# Altium schematic sheet Radio_and_Power.SchDoc
size A4; SheetNumber: 1; SheetTotal: 3
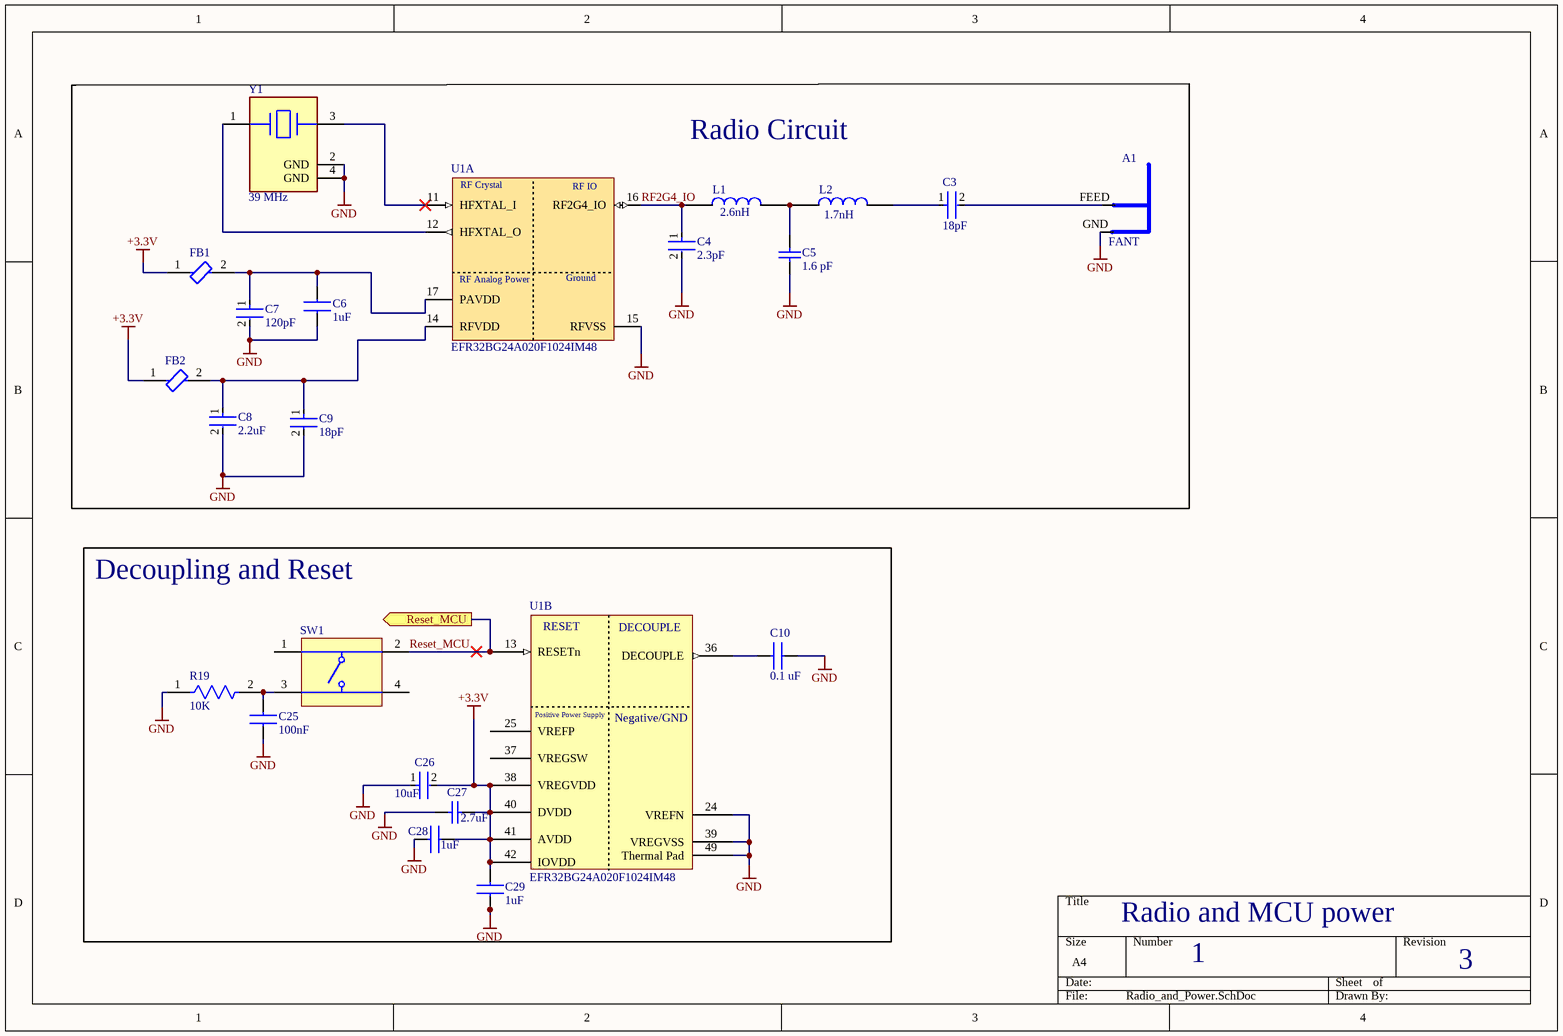
[diagram p0: Radio_and_Power.SchDoc]

## Parts
A1  FANT  [FANT_2P4]
C3  18pF  [FP-GJM155-0_05-MFG]
C4  2.3pF  [FP-GJM155-0_05-IPC_B]
C5  1.6 pF  [CAPC1005X55X25LL05T10]
C6  1uF  [CAP_1uf_2x1.25_0805]
C7  120pF  [FP-CL21-IPC_C]
C8  2.2uF  [FP-CL10-IPC_A]
C9  18pF  [FP-GJM155-0_05-MFG]
C10  0.1 uF  [Cap_1.6X0.8_0603]
C25  100nF  [Cap_1.6X0.8_0603]
C26  10uF  [FP-CL10-IPC_C]
C27  2.7uF  [CAPC2013X145X50LL20T25]
C28  1uF  [CAP_1uf_2x1.25_0805]
C29  1uF  [CAP_1uf_2x1.25_0805]
FB1  BLM18SG700TN1D  [FP-BLM18-0_15-t0_5-d1_2-IPC_A]  (value not drawn)
FB2  BLM18SG700TN1D  [FP-BLM18-0_15-t0_5-d1_2-IPC_A]  (value not drawn)
L1  2.6nH  [Inductor_2.6nH]
L2  1.7nH  [Inductor_1.7nH]
R19  10K  [FP-RMCF0603-IPC_C]
SW1  1825910-6  [TECO-1825910-6_V]  (value not drawn)
U1  EFR32BG24A020F1024IM48  [EFR32BG24_QFN_48_6x6]  (parts A,B of 3)
Y1  39 MHz  [FP-ABM8-MFG]

## Blocks framed on the sheet
Radio Circuit: A1 C3-C9 FB1 FB2 L1 L2 U1 Y1
Decoupling and Reset: C10 C25-C29 R19 SW1 U1

## Ports
Reset_MCU (out, see Sensors[5B])

## Nets
+3.3V: C26.2 C27.2 C28.1 C29.1 FB1.1 FB2.1 U1.38(VREGVDD) U1.40(DVDD) U1.41(AVDD) U1.42(IOVDD)
GND: A1.GND C4.2 C5.1 C6.2 C7.2 C8.2 C9.2 C10.1 C25.2 C26.1 C27.1 C28.2 C29.2 R19.1 U1.15(RFVSS) U1.24(VREFN) U1.39(VREGVSS) U1.49(Thermal_Pad) Y1.2(GND) Y1.4(GND)
Reset_MCU: SW1.2 U1.13(RESETn) ; port Reset_MCU
RF2G4_IO: C4.1 L1.1 U1.16(RF2G4_IO)
NetA1_FEED: A1.FEED C3.2
NetC3_1: C3.1 L2.2
NetC5_2: C5.2 L1.2 L2.1
NetC6_1: C6.1 C7.1 FB1.2 U1.17(PAVDD)
NetC8_1: C8.1 C9.1 FB2.2 U1.14(RFVDD)
NetC10_2: C10.2 U1.36(DECOUPLE)
NetC25_1: C25.1 R19.2 SW1.3
NetU1_11: U1.11(HFXTAL_I) Y1.3
NetU1_12: U1.12(HFXTAL_O) Y1.1

Not connected (* = marked no-connect by the designer): SW1 1 4; U1 25(VREFP) 37(VREGSW)

## Notes on the sheet
- Radio and MCU power
- 1
- 3
- (in symbol EFR32BG24A020F1024IM48-B, part A) RF Crystal; RF IO; Ground; RF Analog Power
- (in symbol EFR32BG24A020F1024IM48-B, part B) RESET; Positive Power Supply; Negative/GND

## Library data of the parts
A1 = F_antenna_2P4
C3 C9 = CMP-2008-03748-2: Multi-Layer Ceramic Capacitor 18pF C0G  ±2% 0402 Paper T/R; Manufacturer: Murata; Manufacturer Part Number: GJM1555C1H180GB01D; Voltage Rating (DC): 50V; Multilayer: Yes; Radiation Hardening: No; Depth: 0.5mm; Dielectric: C0G; Termination: SMD/SMT; Package Quantity: 1; Height: 0.5mm; Thickness: 0.022inch; Mount: Surface Mount; Voltage Rating: 50V; Lead Free: Lead Free; Width: 0.02inch; Case Code (Metric): 1005; Tolerance: 2%; Length: 1mm; Packaging: Tape and Reel; Case Code (Imperial): 0402; Max Operating Temperature: 125°C; Case/Package: 0402; Min Operating Temperature: -55°C; Capacitance: 18pF; Supplier: Digikey; Supplier Part Number: 490-8082-1-ND; RoHS: Yes; Category: Ceramic Capacitors; Stock: 138833; Pricing: 1=0.15, 10=0.087, 50=0.0608, 100=0.0526, 500=0.03882, 1000=0.03453, 2500=0.02999, 5000=0.02723, 10000=0.02496, 20000=0.02307, 30000=0.02212, 50000=0.02107, 70000=0.02045, 100000=0.01985, 250000=0.01856, 500000=0.01777 (USD); Mounting Technology: Surface Mount; Pins: 2; Dielectric Material: Ceramic; Package Shape: Rectangular; Terminal Finish: Nickel; JESD-609 Code: e3; Value: 18pF; Capacitor Type: Ceramic; Tolerance  (fill in as +-): 2%; Package Style: SMTMeter; Tolerance (fill in as +-): 2%; Rated DC Voltage (URdc): 50V; Temperature Characteristics Code: C0G; Reach SVHC Compliant: Yes; RoHS Compliant: Yes; ComponentLink1URL: https://datasheet.ciiva.com:443/pdfs/VipMasterIC/IC/MURE/MURE-S-A0008911154/MURE-S-A0008911186-1.pdf?src-supplier=IHS+Markit; ComponentLink1Description: https://datasheet.ciiva.com:443/pdfs/VipMasterIC/IC/MURE/MURE-S-A0008911154/MURE-S-A0008911186-1.pdf?src-supplier=IHS+Markit; ComponentLink2URL: https://datasheet.ciiva.com/29542/partnumbering-e-01-29542361.pdf?src-supplier=Digikey; ComponentLink2Description: https://datasheet.ciiva.com/29542/partnumbering-e-01-29542361.pdf?src-supplier=Digikey; ComponentLink3URL: https://datasheet.ciiva.com/29542/partnumbering-e-01-29542362.pdf?src-supplier=Digikey; ComponentLink3Description: https://datasheet.ciiva.com/29542/partnumbering-e-01-29542362.pdf?src-supplier=Digikey; ComponentLink4URL: https://datasheet.ciiva.com/29542/partnumbering-e-01-29542363.pdf?src-supplier=Digikey; ComponentLink4Description: https://datasheet.ciiva.com/29542/partnumbering-e-01-29542363.pdf?src-supplier=Digikey
C4 = CMP-06035-043077-1: Multi-Layer Ceramic Capacitor 2.3pF C0G  ±0.1pF 0402 Paper T/R; Manufacturer: Murata; Manufacturer Part Number: GJM1555C1H2R3BB01D; Voltage Rating (DC): 50V; Multilayer: Yes; Tolerance  (fill in as +-): 4.35%; Case/Package: 0402; Min Operating Temperature: -55°C; Dielectric: C0G; Max Operating Temperature: 125°C; Width: 0.02inch; Packaging: Tape and Reel; Mount: Surface Mount; Length: 1mm; Voltage Rating: 50V; Case Code (Metric): 1005; Termination: SMD/SMT; Thickness: 0.022inch; Radiation Hardening: No; Depth: 0.5mm; Package Quantity: 10000; Capacitance: 2.3pF; Height: 0.5mm; Case Code (Imperial): 0402; Supplier: Digikey; Supplier Part Number: 490-GJM1555C1H2R3BB01DCT-ND; RoHS: Yes; Category: Ceramic Capacitors; Stock: 24955; Pricing: 1=0.1, 10=0.057, 50=0.0394, 100=0.0338, 500=0.02456, 1000=0.02168, 2500=0.01863, 5000=0.01678 (USD); Mounting Technology: Surface Mount; Pins: 2; Dielectric Material: Ceramic; Package Shape: Rectangular; Terminal Finish: Nickel; JESD-609 Code: e3; Value: 2.3pF; Capacitor Type: Ceramic; Package Style: SMTMeter; Tolerance (fill in as +-): 4.35%; Rated DC Voltage (URdc): 50V; Temperature Characteristics Code: C0G; Reach SVHC Compliant: Yes; RoHS Compliant: Yes; ComponentLink1URL: https://datasheet.ciiva.com:443/pdfs/VipMasterIC/IC/MURE/MURE-S-A0004378008/MURE-S-A0004382787-1.pdf?src-supplier=IHS+Markit; ComponentLink1Description: https://datasheet.ciiva.com:443/pdfs/VipMasterIC/IC/MURE/MURE-S-A0004378008/MURE-S-A0004382787-1.pdf?src-supplier=IHS+Markit; ComponentLink2URL: https://datasheet.ciiva.com/166/product-166998.pdf?src-supplier=Digikey; ComponentLink2Description: https://datasheet.ciiva.com/166/product-166998.pdf?src-supplier=Digikey
C5 = CMP-1034-00125-2: Manufacturer: Murata; Part Number: GRM1555C1H1R6BA01D; Description: Ceramic Capacitor, Multilayer, Ceramic, 50V, 6.25% +Tol, 6.25% -Tol, C0G, 30ppm/Cel TC, 0.0000016uF, Surface Mount, 0402; Dielectric Material: Ceramic; Value: 1.6pF; Multilayer: Yes; Tolerance  (fill in as +-): 6.25%; Rated DC Voltage (URdc): 50V; Temperature Characteristics Code: C0G; Supplier: Digikey; Supplier Part Number: 490-6214-1-ND; Manufacturer Part Number: GRM1555C1H1R6BA01D; RoHS: Yes; Category: Ceramic Capacitors; Stock: 106623; Pricing: 1=0.1, 10=0.043, 50=0.0294, 100=0.0252, 500=0.01812, 1000=0.01592, 2500=0.01358, 5000=0.01216 (USD); Mounting Technology: Surface Mount; Pins: 2; Package Shape: Rectangular; Case/Package: 0402; Terminal Finish: Nickel; Min Operating Temperature: -55°C; Max Operating Temperature: 125°C; JESD-609 Code: e3; Capacitor Type: Ceramic; Package Style: SMTMeter; Packaging: Tape and Reel; Tolerance (fill in as +-): 6.25%; Termination: Wraparound; Length: 1mm; Width: 0.5mm; Height: 0.5mm; Reach SVHC Compliant: Yes; RoHS Compliant: Yes; ComponentLink1URL: https://datasheet.ciiva.com:443/pdfs/VipMasterIC/IC/MURE/MURE-S-A0004280628/MURE-S-A0004344755-1.pdf?src-supplier=IHS+Markit; ComponentLink1Description: https://datasheet.ciiva.com:443/pdfs/VipMasterIC/IC/MURE/MURE-S-A0004280628/MURE-S-A0004344755-1.pdf?src-supplier=IHS+Markit; ComponentLink2URL: https://datasheet.ciiva.com/6270/grm1555c1h1r6ba01-01-6270912.pdf?src-supplier=Digikey; ComponentLink2Description: https://datasheet.ciiva.com/6270/grm1555c1h1r6ba01-01-6270912.pdf?src-supplier=Digikey; ComponentLink3URL: https://datasheet.ciiva.com/11615/product-11615783.pdf?src-supplier=Avnet; ComponentLink3Description: https://datasheet.ciiva.com/11615/product-11615783.pdf?src-supplier=Avnet; ComponentLink4URL: https://datasheet.ciiva.com/18184/getdatasheetpartid-319318-18184245.pdf?src-supplier=Verical; ComponentLink4Description: https://datasheet.ciiva.com/18184/getdatasheetpartid-319318-18184245.pdf?src-supplier=Verical; ComponentLink5URL: https://datasheet.ciiva.com/6270/partnumbering-e-01-6270909.pdf?src-supplier=Digikey; ComponentLink5Description: https://datasheet.ciiva.com/6270/partnumbering-e-01-6270909.pdf?src-supplier=Digikey; ComponentLink6URL: https://datasheet.ciiva.com/5438/product-5438044.pdf?src-supplier=Mouser; ComponentLink6Description: https://datasheet.ciiva.com/5438/product-5438044.pdf?src-supplier=Mouser
C6 C28 C29 = Cap_0805: Multilayer Ceramic Capacitor, 1 uF, 25 V, ï¿½ 10%, X7R, 0805 [2012 Metric]; Manufacturer: Samsung; Manufacturer Part Number: CL21B105KAFNNNE; Voltage: 25V; Supplier: Digikey; Supplier Part Number: 1276-1066-1-ND; RoHS: Yes; Category: Ceramic Capacitors; Stock: 1207799; Pricing: 1=0.1, 10=0.062, 50=0.0356, 100=0.0276, 500=0.02078, 1000=0.01633 (USD); Mounting Technology: Surface Mount; Case/Package: 0805; Case Code (Metric): 2012; Case Code (Imperial): 0805; Min Operating Temperature: -55°C; Max Operating Temperature: 125°C; Value: 1uF; Tolerance: 10%; Dielectric: X7R; Voltage Rating (DC): 25V; Series: CL; Packaging: Tape and Reel; Voltage Rating: 25V; Package Quantity: 1; Construction: Flat; Length: 2mm; Width: 0.049inch; Height: 1.25mm; Depth: 1.25mm; Thickness: 0.053inch; Radiation Hardening: No; Lead Free: Lead Free; RoHS Compliant: Yes; ComponentLink1URL: https://datasheet.ciiva.com/25800/cl21b105kafnnne-25800163.pdf?src-supplier=Digikey; ComponentLink1Description: https://datasheet.ciiva.com/25800/cl21b105kafnnne-25800163.pdf?src-supplier=Digikey; ComponentLink2URL: https://datasheet.ciiva.com/15195/getdatasheetpartid-355205-15195880.pdf?src-supplier=Verical; ComponentLink2Description: https://datasheet.ciiva.com/15195/getdatasheetpartid-355205-15195880.pdf?src-supplier=Verical
C7 = CMP-13271-002834-1: CL21 Series 0805 120pF 200V ±5% Tolerance C0G Multilayer Ceramic Chip Capacitor; Manufacturer: Samsung; Manufacturer Part Number: CL21C121JDCNNNC; Multilayer: Yes; Case Code (Imperial): 0805; Depth: 1.25mm; Voltage Rating (DC): 200V; Capacitance: 120pF; Radiation Hardening: No; Packaging: Tape and Reel; Case/Package: 0805; Tolerance: 5%; Height: 0.85mm; Min Operating Temperature: -55°C; Thickness: 0.037inch; Max Operating Temperature: 125°C; Mount: Surface Mount; Package Quantity: 1; Dielectric: C0G; Case Code (Metric): 2012; Length: 2mm; Lead Free: Lead Free; Width: 0.049inch; Voltage Rating: 200V; Supplier: Digikey; Supplier Part Number: 1276-1201-1-ND; RoHS: Yes; Category: Ceramic Capacitors; Stock: 1615424; Pricing: 1=0.1, 10=0.053, 50=0.0316, 100=0.0249, 500=0.01836, 1000=0.0152 (USD); Mounting Technology: Surface Mount; Pins: 2; Dielectric Material: Ceramic; Package Shape: Rectangular; Terminal Finish: Nickel; JESD-609 Code: e3; Value: 120pF; Capacitor Type: Ceramic; Tolerance  (fill in as +-): 5%; Package Style: SMTMeter; Tolerance (fill in as +-): 5%; Rated DC Voltage (URdc): 200V; Temperature Characteristics Code: C0G; Termination: Wraparound; Reach SVHC Compliant: Yes; RoHS Compliant: Yes; ComponentLink1URL: https://datasheet.ciiva.com:443/pdfs/VipMasterIC/IC/SEMS/SEMS-S-A0008522756/SEMS-S-A0008522707-1.pdf?src-supplier=IHS+Markit; ComponentLink1Description: https://datasheet.ciiva.com:443/pdfs/VipMasterIC/IC/SEMS/SEMS-S-A0008522756/SEMS-S-A0008522707-1.pdf?src-supplier=IHS+Markit; ComponentLink2URL: https://datasheet.ciiva.com/25737/cl21c121jdcnnnc-25737252.pdf?src-supplier=Digikey; ComponentLink2Description: https://datasheet.ciiva.com/25737/cl21c121jdcnnnc-25737252.pdf?src-supplier=Digikey
C8 = CMP-13271-000835-1: Cap Ceramic 2.2uF 16V X5R ±10% Pad SMD 0603 +85°C T/R; Manufacturer: Samsung; Manufacturer Part Number: CL10A225KO8NNNC; Multilayer: Yes; Case Code (Metric): 1608; Height: 0.8mm; Case/Package: 0603; Depth: 0.8mm; Capacitance: 2.2uF; Voltage Rating: 16V; Case Code (Imperial): 0603; Length: 1.6mm; Packaging: Tape and Reel; Material: Ceramic; Lead Free: Lead Free; Max Operating Temperature: 85°C; Contact Plating: Tin; Thickness: 0.035inch; Radiation Hardening: No; Tolerance: 10%; Min Operating Temperature: -55°C; Voltage: 16V; Dielectric: X5R; Mount: Surface Mount; Package Quantity: 4000; Width: 0.031inch; Voltage Rating (DC): 16V; Supplier: Digikey; Supplier Part Number: 1276-1040-1-ND; RoHS: Yes; Category: Ceramic Capacitors; Stock: 858374; Pricing: 1=0.1, 10=0.06, 50=0.0346, 100=0.0269, 500=0.02022, 1000=0.01589 (USD); Mounting Technology: Surface Mount; Pins: 2; Dielectric Material: Ceramic; Package Shape: Rectangular; Terminal Finish: Nickel; JESD-609 Code: e3; Value: 2.2uF; Capacitor Type: Ceramic; Tolerance  (fill in as +-): 10%; Package Style: SMTMeter; Tolerance (fill in as +-): 10%; Rated DC Voltage (URdc): 16V; Temperature Characteristics Code: X5R; Termination: Wraparound; Reach SVHC Compliant: Yes; RoHS Compliant: Yes; ComponentLink1URL: https://datasheet.ciiva.com:443/pdfs/VipMasterIC/IC/SEMS/SEMS-S-A0008524842/SEMS-S-A0008524788-1.pdf?src-supplier=IHS+Markit; ComponentLink1Description: https://datasheet.ciiva.com:443/pdfs/VipMasterIC/IC/SEMS/SEMS-S-A0008524842/SEMS-S-A0008524788-1.pdf?src-supplier=IHS+Markit; ComponentLink2URL: https://datasheet.ciiva.com/25798/cl10a225ko8nnnc-25798421.pdf?src-supplier=Digikey; ComponentLink2Description: https://datasheet.ciiva.com/25798/cl10a225ko8nnnc-25798421.pdf?src-supplier=Digikey; ComponentLink3URL: https://datasheet.ciiva.com/26838/getdatasheetpartid-355165-26838356.pdf?src-supplier=Verical; ComponentLink3Description: https://datasheet.ciiva.com/26838/getdatasheetpartid-355165-26838356.pdf?src-supplier=Verical; ComponentLink4URL: https://datasheet.ciiva.com/29198/457919-da-01-en-vs-kondensator-0603-29198587.pdf?src-supplier=Conrad; ComponentLink4Description: https://datasheet.ciiva.com/29198/457919-da-01-en-vs-kondensator-0603-29198587.pdf?src-supplier=Conrad; ComponentLink5URL: https://datasheet.ciiva.com/16342/cl05b104kq5nnnc-16342714.pdf?src-supplier=Future+Electronics; ComponentLink5Description: https://datasheet.ciiva.com/16342/cl05b104kq5nnnc-16342714.pdf?src-supplier=Future+Electronics
C10 = Cap_0603: Ceramic Capacitor, Multilayer, Ceramic, 16V, 10% +Tol, 10% -Tol, X7R, 15% TC, 0.1uF, Surface Mount, 0603; Manufacturer: Yageo; Manufacturer Part Number: CC0603KRX7R7BB104; Value: 100nF; Multilayer: Yes; Supplier: Digikey; Supplier Part Number: 311-1088-1-ND; RoHS: Yes; Category: Ceramic Capacitors; Stock: 8597381; Pricing: 1=0.1, 10=0.042, 50=0.0238, 100=0.0185, 500=0.01392, 1000=0.01094, 4000=0.00915, 8000=0.00836, 12000=0.00796, 28000=0.00756, 100000=0.00547, 200000=0.00529, 400000=0.00497 (USD); Mounting Technology: Surface Mount; Pins: 2; Dielectric Material: Ceramic; Package Shape: Rectangular; Case/Package: 0603; Terminal Finish: Nickel; Min Operating Temperature: -55°C; Max Operating Temperature: 125°C; JESD-609 Code: e3; Capacitor Type: Ceramic; Tolerance  (fill in as +-): 10%; Package Style: SMTMeter; Packaging: Tape and Reel; Tolerance (fill in as +-): 10%; Rated DC Voltage (URdc): 16V; Temperature Characteristics Code: X7R; Termination: Wraparound; Length: 1.6mm; Width: 0.8mm; Height: 0.8mm; Reach SVHC Compliant: Yes; RoHS Compliant: Yes; ComponentLink1URL: https://datasheet.ciiva.com:443/pdfs/VipMasterIC/IC/YAGO/YAGO-S-A0003557223/YAGO-S-A0003557223-1.pdf?src-supplier=IHS+Markit; ComponentLink1Description: https://datasheet.ciiva.com:443/pdfs/VipMasterIC/IC/YAGO/YAGO-S-A0003557223/YAGO-S-A0003557223-1.pdf?src-supplier=IHS+Markit; ComponentLink2URL: https://datasheet.ciiva.com/11786/0900766b80d84f1d-11786077.pdf?src-supplier=Rs; ComponentLink2Description: https://datasheet.ciiva.com/11786/0900766b80d84f1d-11786077.pdf?src-supplier=Rs; ComponentLink3URL: https://datasheet.ciiva.com/46430/1734573-46430156.pdf?src-supplier=Element14; ComponentLink3Description: https://datasheet.ciiva.com/46430/1734573-46430156.pdf?src-supplier=Element14; ComponentLink4URL: https://datasheet.ciiva.com/8033/1734573-8033797.pdf?src-supplier=Element14; ComponentLink4Description: https://datasheet.ciiva.com/8033/1734573-8033797.pdf?src-supplier=Element14; ComponentLink5URL: https://datasheet.ciiva.com/8033/70765-8033799.pdf?src-supplier=Element14; ComponentLink5Description: https://datasheet.ciiva.com/8033/70765-8033799.pdf?src-supplier=Element14; ComponentLink6URL: https://datasheet.ciiva.com/28450/1489800-28450552.pdf?src-supplier=Element14; ComponentLink6Description: https://datasheet.ciiva.com/28450/1489800-28450552.pdf?src-supplier=Element14; ComponentLink7URL: https://datasheet.ciiva.com/144/mlccorderingcode-144182.pdf?src-supplier=Digikey; ComponentLink7Description: https://datasheet.ciiva.com/144/mlccorderingcode-144182.pdf?src-supplier=Digikey; ComponentLink8URL: https://datasheet.ciiva.com/144/mlccorderingcode-144183.pdf?src-supplier=Digikey; ComponentLink8Description: https://datasheet.ciiva.com/144/mlccorderingcode-144183.pdf?src-supplier=Digikey; ComponentLink9URL: https://datasheet.ciiva.com/144/mlccorderingcode-144184.pdf?src-supplier=Digikey; ComponentLink9Description: https://datasheet.ciiva.com/144/mlccorderingcode-144184.pdf?src-supplier=Digikey; ComponentLink10URL: https://datasheet.ciiva.com/11464/upy-gphc-x7r-6-3v-to-50v-8-11464735.pdf?src-supplier=Avnet; ComponentLink10Description: https://datasheet.ciiva.com/11464/upy-gphc-x7r-6-3v-to-50v-8-11464735.pdf?src-supplier=Avnet; ComponentLink11URL: https://datasheet.ciiva.com/13395/upy-gphc-x7r-6-3v-to-50v-8-13395674.pdf?src-supplier=Mouser; ComponentLink11Description: https://datasheet.ciiva.com/13395/upy-gphc-x7r-6-3v-to-50v-8-13395674.pdf?src-supplier=Mouser; ComponentLink12URL: https://datasheet.ciiva.com/7978/1489800-7978141.pdf?src-supplier=Element14; ComponentLink12Description: https://datasheet.ciiva.com/7978/1489800-7978141.pdf?src-supplier=Element14
C25 = Cap_0603: Ceramic Capacitor, Multilayer, Ceramic, 16V, 10% +Tol, 10% -Tol, X7R, 15% TC, 0.1uF, Surface Mount, 0603; Manufacturer: Yageo; Manufacturer Part Number: CC0603KRX7R7BB104; Multilayer: Yes; Supplier: Digikey; Supplier Part Number: 311-1088-1-ND; RoHS: Yes; Category: Ceramic Capacitors; Stock: 8597381; Pricing: 1=0.1, 10=0.042, 50=0.0238, 100=0.0185, 500=0.01392, 1000=0.01094, 4000=0.00915, 8000=0.00836, 12000=0.00796, 28000=0.00756, 100000=0.00547, 200000=0.00529, 400000=0.00497 (USD); Mounting Technology: Surface Mount; Pins: 2; Dielectric Material: Ceramic; Package Shape: Rectangular; Case/Package: 0603; Terminal Finish: Nickel; Min Operating Temperature: -55°C; Max Operating Temperature: 125°C; JESD-609 Code: e3; Value: 100nF; Capacitor Type: Ceramic; Tolerance  (fill in as +-): 10%; Package Style: SMTMeter; Packaging: Tape and Reel; Tolerance (fill in as +-): 10%; Rated DC Voltage (URdc): 16V; Temperature Characteristics Code: X7R; Termination: Wraparound; Length: 1.6mm; Width: 0.8mm; Height: 0.8mm; Reach SVHC Compliant: Yes; RoHS Compliant: Yes; ComponentLink1URL: https://datasheet.ciiva.com:443/pdfs/VipMasterIC/IC/YAGO/YAGO-S-A0003557223/YAGO-S-A0003557223-1.pdf?src-supplier=IHS+Markit; ComponentLink1Description: https://datasheet.ciiva.com:443/pdfs/VipMasterIC/IC/YAGO/YAGO-S-A0003557223/YAGO-S-A0003557223-1.pdf?src-supplier=IHS+Markit; ComponentLink2URL: https://datasheet.ciiva.com/11786/0900766b80d84f1d-11786077.pdf?src-supplier=Rs; ComponentLink2Description: https://datasheet.ciiva.com/11786/0900766b80d84f1d-11786077.pdf?src-supplier=Rs; ComponentLink3URL: https://datasheet.ciiva.com/46430/1734573-46430156.pdf?src-supplier=Element14; ComponentLink3Description: https://datasheet.ciiva.com/46430/1734573-46430156.pdf?src-supplier=Element14; ComponentLink4URL: https://datasheet.ciiva.com/8033/1734573-8033797.pdf?src-supplier=Element14; ComponentLink4Description: https://datasheet.ciiva.com/8033/1734573-8033797.pdf?src-supplier=Element14; ComponentLink5URL: https://datasheet.ciiva.com/8033/70765-8033799.pdf?src-supplier=Element14; ComponentLink5Description: https://datasheet.ciiva.com/8033/70765-8033799.pdf?src-supplier=Element14; ComponentLink6URL: https://datasheet.ciiva.com/28450/1489800-28450552.pdf?src-supplier=Element14; ComponentLink6Description: https://datasheet.ciiva.com/28450/1489800-28450552.pdf?src-supplier=Element14; ComponentLink7URL: https://datasheet.ciiva.com/144/mlccorderingcode-144182.pdf?src-supplier=Digikey; ComponentLink7Description: https://datasheet.ciiva.com/144/mlccorderingcode-144182.pdf?src-supplier=Digikey; ComponentLink8URL: https://datasheet.ciiva.com/144/mlccorderingcode-144183.pdf?src-supplier=Digikey; ComponentLink8Description: https://datasheet.ciiva.com/144/mlccorderingcode-144183.pdf?src-supplier=Digikey; ComponentLink9URL: https://datasheet.ciiva.com/144/mlccorderingcode-144184.pdf?src-supplier=Digikey; ComponentLink9Description: https://datasheet.ciiva.com/144/mlccorderingcode-144184.pdf?src-supplier=Digikey; ComponentLink10URL: https://datasheet.ciiva.com/11464/upy-gphc-x7r-6-3v-to-50v-8-11464735.pdf?src-supplier=Avnet; ComponentLink10Description: https://datasheet.ciiva.com/11464/upy-gphc-x7r-6-3v-to-50v-8-11464735.pdf?src-supplier=Avnet; ComponentLink11URL: https://datasheet.ciiva.com/13395/upy-gphc-x7r-6-3v-to-50v-8-13395674.pdf?src-supplier=Mouser; ComponentLink11Description: https://datasheet.ciiva.com/13395/upy-gphc-x7r-6-3v-to-50v-8-13395674.pdf?src-supplier=Mouser; ComponentLink12URL: https://datasheet.ciiva.com/7978/1489800-7978141.pdf?src-supplier=Element14; ComponentLink12Description: https://datasheet.ciiva.com/7978/1489800-7978141.pdf?src-supplier=Element14
C26 = CMP-13271-001938-1: Cap Ceramic 10uF 6.3V X5R ±20% Pad SMD 0603 +85°C T/R; Manufacturer: Samsung; Manufacturer Part Number: CL10A106MQ8NNNC; Multilayer: Yes; Contact Plating: Tin; Height: 0.8mm; Width: 0.031inch; Min Operating Temperature: -55°C; Capacitance: 10uF; Dielectric: X5R; Voltage Rating: 6.3V; Case/Package: 0603; Package Quantity: 1; Radiation Hardening: No; Packaging: Tape and Reel; Max Operating Temperature: 85°C; Voltage: 6.3V; Thickness: 0.035inch; Mount: Surface Mount; Case Code (Imperial): 0603; Case Code (Metric): 1608; Depth: 0.8mm; Tolerance: 20%; Length: 1.6mm; Supplier: Digikey; Supplier Part Number: 1276-1119-1-ND; RoHS: Yes; Category: Ceramic Capacitors; Stock: 1225004; Pricing: 1=0.1, 10=0.055, 50=0.038, 100=0.0327, 500=0.02374, 1000=0.02096, 4000=0.01676, 8000=0.01518, 12000=0.01439, 20000=0.01351, 28000=0.013, 40000=0.0125, 100000=0.01142, 200000=0.01077, 400000=0.01023 (USD); Mounting Technology: Surface Mount; Pins: 2; Dielectric Material: Ceramic; Package Shape: Rectangular; Terminal Finish: Nickel; JESD-609 Code: e3; Value: 10uF; Capacitor Type: Ceramic; Tolerance  (fill in as +-): 20%; Package Style: SMTMeter; Tolerance (fill in as +-): 20%; Rated DC Voltage (URdc): 6.3V; Temperature Characteristics Code: X5R; Termination: Wraparound; Reach SVHC Compliant: Yes; RoHS Compliant: Yes; ComponentLink1URL: https://datasheet.ciiva.com:443/pdfs/VipMasterIC/IC/SEMS/SEMS-S-A0008522793/SEMS-S-A0008522915-1.pdf?src-supplier=IHS+Markit; ComponentLink1Description: https://datasheet.ciiva.com:443/pdfs/VipMasterIC/IC/SEMS/SEMS-S-A0008522793/SEMS-S-A0008522915-1.pdf?src-supplier=IHS+Markit; ComponentLink2URL: https://datasheet.ciiva.com/25798/cl10a106mq8nnnc-25798320.pdf?src-supplier=Digikey; ComponentLink2Description: https://datasheet.ciiva.com/25798/cl10a106mq8nnnc-25798320.pdf?src-supplier=Digikey; ComponentLink3URL: https://datasheet.ciiva.com/26838/getdatasheetpartid-357557-26838347.pdf?src-supplier=Verical; ComponentLink3Description: https://datasheet.ciiva.com/26838/getdatasheetpartid-357557-26838347.pdf?src-supplier=Verical; ComponentLink4URL: https://datasheet.ciiva.com/16437/cl05b104kq5nnnc-16437327.pdf?src-supplier=Future+Electronics; ComponentLink4Description: https://datasheet.ciiva.com/16437/cl05b104kq5nnnc-16437327.pdf?src-supplier=Future+Electronics
C27 = CMP-1036-04849-2: Part Number: C0805C275K8PACTU; Manufacturer: Kemet; Dielectric Material: Ceramic; Multilayer: Yes; Tolerance  (fill in as +-): 10%; Rated DC Voltage (URdc): 10V; Temperature Characteristics Code: X5R; Supplier: Digikey; Supplier Part Number: 399-C0805C275K8PAC7800CT-ND; Manufacturer Part Number: C0805C275K8PACTU; RoHS: Yes; Category: Ceramic Capacitors; Stock: 11348; Pricing: 1=0.59, 10=0.354, 50=0.26, 100=0.2308, 500=0.18098, 1000=0.16543 (USD); Mounting Technology: Surface Mount; Pins: 2; Package Shape: Rectangular; Case/Package: 0805; Terminal Finish: Nickel; Min Operating Temperature: -55°C; Max Operating Temperature: 85°C; JESD-609 Code: e3; Value: 2.7uF; Capacitor Type: Ceramic; Package Style: SMTMeter; Packaging: Tape and Reel; Tolerance (fill in as +-): 10%; Termination: Wraparound; Length: 2mm; Width: 1.25mm; Height: 0.95mm; Reach SVHC Compliant: Yes; RoHS Compliant: Yes; ComponentLink1URL: https://datasheet.ciiva.com:443/pdfs/VipMasterIC/IC/KEME/KEME-S-A0008991665/KEME-S-A0008991665-1.pdf?src-supplier=IHS+Markit; ComponentLink1Description: https://datasheet.ciiva.com:443/pdfs/VipMasterIC/IC/KEME/KEME-S-A0008991665/KEME-S-A0008991665-1.pdf?src-supplier=IHS+Markit; ComponentLink2URL: https://www.alliedelec.com/m/d/7f88201dbaab65c95b0b8234579261a3.pdf?src-supplier=Allied+Electronics; ComponentLink2Description: https://www.alliedelec.com/m/d/7f88201dbaab65c95b0b8234579261a3.pdf?src-supplier=Allied+Electronics; ComponentLink3URL: http://www.mouser.com/ds/2/212/KEM_C1006_X5R_SMD-1103249.pdf?src-supplier=Mouser; ComponentLink3Description: http://www.mouser.com/ds/2/212/KEM_C1006_X5R_SMD-1103249.pdf?src-supplier=Mouser; ComponentLink4URL: http://components.arrow.com/part/dataview/40912422S7467711N7429?src-supplier=Arrow+Electronics; ComponentLink4Description: http://components.arrow.com/part/dataview/40912422S7467711N7429?src-supplier=Arrow+Electronics; ComponentLink5URL: https://www.alliedelec.com/m/d/fc0aaf5de6140bfa85cbf42aaccfae41.pdf?src-supplier=Allied+Electronics; ComponentLink5Description: https://www.alliedelec.com/m/d/fc0aaf5de6140bfa85cbf42aaccfae41.pdf?src-supplier=Allied+Electronics; ComponentLink6URL: http://uk.rs-online.com/webdocs/13da/0900766b813da6d7.pdf?src-supplier=Rs; ComponentLink6Description: http://uk.rs-online.com/webdocs/13da/0900766b813da6d7.pdf?src-supplier=Rs; ComponentLink7URL: http://uk.rs-online.com/webdocs/13da/0900766b813da6d8.pdf?src-supplier=Rs; ComponentLink7Description: http://uk.rs-online.com/webdocs/13da/0900766b813da6d8.pdf?src-supplier=Rs; ComponentLink8URL: https://datasheet.octopart.com/C0805C275K8PACTU-KEMET-datasheet-149524257.pdf?src-supplier=Farnell; ComponentLink8Description: https://datasheet.octopart.com/C0805C275K8PACTU-KEMET-datasheet-149524257.pdf?src-supplier=Farnell; ComponentLink9URL: http://capacitoredge.kemet.com/capedge2/DataSheet?pn=C0805C275K8PAC7800&src-supplier=Avnet; ComponentLink9Description: http://capacitoredge.kemet.com/capedge2/DataSheet?pn=C0805C275K8PAC7800&src-supplier=Avnet; ComponentLink10URL: https://search.kemet.com/component-edge/download/datasheet/C0805C275K8PACTU.pdf?src-supplier=Digikey; ComponentLink10Description: https://search.kemet.com/component-edge/download/datasheet/C0805C275K8PACTU.pdf?src-supplier=Digikey; ComponentLink11URL: https://api.kemet.com/component-edge/download/datasheet/C0805C275K8PACTU.pdf?src-supplier=Digikey; ComponentLink11Description: https://api.kemet.com/component-edge/download/datasheet/C0805C275K8PACTU.pdf?src-supplier=Digikey; ComponentLink12URL: https://datasheet.octopart.com/C0805C275K8PACTU-Kemet-datasheet-62307650.pdf?src-supplier=Element14; ComponentLink12Description: https://datasheet.octopart.com/C0805C275K8PACTU-Kemet-datasheet-62307650.pdf?src-supplier=Element14; ComponentLink13URL: https://datasheet.octopart.com/C0805C275K8PACTU-KEMET-datasheet-176289658.pdf?src-supplier=Newark; ComponentLink13Description: https://datasheet.octopart.com/C0805C275K8PACTU-KEMET-datasheet-176289658.pdf?src-supplier=Newark; ComponentLink14URL: https://datasheet.octopart.com/C0805C275K8PACTU-KEMET-datasheet-86780295.pdf?src-supplier=Newark; ComponentLink14Description: https://datasheet.octopart.com/C0805C275K8PACTU-KEMET-datasheet-86780295.pdf?src-supplier=Newark; ComponentLink15URL: https://datasheet.octopart.com/C0805C275K8PACTU-KEMET-datasheet-134136060.pdf?src-supplier=Electro+Sonic; ComponentLink15Description: https://datasheet.octopart.com/C0805C275K8PACTU-KEMET-datasheet-134136060.pdf?src-supplier=Electro+Sonic; ComponentLink16URL: https://datasheet.octopart.com/C0805C275K8PACTU-KEMET-datasheet-140424736.pdf?src-supplier=TME; ComponentLink16Description: https://datasheet.octopart.com/C0805C275K8PACTU-KEMET-datasheet-140424736.pdf?src-supplier=TME
FB1 FB2 = CMP-0686-00597-5: Chip Ferrite Bead, 0603, 70Ω @ 100MHz, 25%, 0.02Ω, 4A; Manufacturer: Murata; DC Resistance (DCR): 20mR; Material: Steel; Number of Circuits: 1; Impedance: 70R; Filter Type: FERRITE CHIP; Max DC Current: 4A; Lead Free: Lead Free; Min Operating Temperature: -55°C; Case Code (Imperial): 0603; Width: 0.8mm; Tolerance: 25%; Case Code (Metric): 1608; RoHS Compliant: Yes; Core Material: Ferrite; Max Operating Temperature: 125°C; Test Frequency: 100MHz; Number of Pins: 2; Current Rating: 4A; Series: BLM18S; Depth: 0.8mm; Packaging: Tape and Reel; Height: 0.8mm; Number of Lines: 1; Case/Package: 0603; Package Quantity: 1; Termination: SMD/SMT; REACH SVHC: No SVHC; Max Current Rating: 4A; DC Resistance-Max: 20mR; Length: 1.6mm; Supplier: Digikey; Supplier Part Number: 490-5224-1-ND; Manufacturer Part Number: BLM18SG700TN1D; RoHS: Yes; Category: Ferrite Beads and Chips; Stock: 252724; Pricing: 1=0.14, 10=0.096, 25=0.0828, 50=0.0742, 100=0.0664, 250=0.05708, 500=0.05068, 1000=0.04481, 5000=0.03287, 10000=0.02938 (USD); Mounting Technology: Surface Mount; Case Code: 0603; Terminal Finish: Tin; JESD-609 Code: e3; Construction: Chip Bead; Clock Frequency: 100MHz; Min Frequency: 100MHz; Channels: 1; Output Impedance: 70R; Reach SVHC Compliant: Yes; ComponentLink1URL: https://datasheet.ciiva.com:443/pdfs/VipMasterIC/IC/MURE/MURE-S-A0008515766/MURE-S-A0008515869-1.pdf?src-supplier=IHS+Markit; ComponentLink1Description: https://datasheet.ciiva.com:443/pdfs/VipMasterIC/IC/MURE/MURE-S-A0008515766/MURE-S-A0008515869-1.pdf?src-supplier=IHS+Markit; ComponentLink2URL: https://datasheet.ciiva.com/8021/5151-8021529.pdf?src-supplier=Element14; ComponentLink2Description: https://datasheet.ciiva.com/8021/5151-8021529.pdf?src-supplier=Element14; ComponentLink3URL: https://datasheet.ciiva.com/8021/5151-8021530.pdf?src-supplier=Element14; ComponentLink3Description: https://datasheet.ciiva.com/8021/5151-8021530.pdf?src-supplier=Element14; ComponentLink4URL: https://datasheet.ciiva.com/14122/blm-series-eng-tds-14122901.pdf?src-supplier=Distrelec; ComponentLink4Description: https://datasheet.ciiva.com/14122/blm-series-eng-tds-14122901.pdf?src-supplier=Distrelec; ComponentLink5URL: https://datasheet.ciiva.com/6212/l0110s0100blm18s-6212357.pdf?src-supplier=Digikey; ComponentLink5Description: https://datasheet.ciiva.com/6212/l0110s0100blm18s-6212357.pdf?src-supplier=Digikey; ComponentLink6URL: https://datasheet.ciiva.com/6212/l0110s0100blm18s-6212359.pdf?src-supplier=Digikey; ComponentLink6Description: https://datasheet.ciiva.com/6212/l0110s0100blm18s-6212359.pdf?src-supplier=Digikey; ComponentLink7URL: https://datasheet.ciiva.com/16420/l0110s0100blm18s-16420729.pdf?src-supplier=Future+Electronics; ComponentLink7Description: https://datasheet.ciiva.com/16420/l0110s0100blm18s-16420729.pdf?src-supplier=Future+Electronics
L1 = Inductor_2.6nH: General Purpose Inductor, 0.0026uH, 11.538%, 1 Element, SMD, 0402; Manufacturer: Murata; Manufacturer Part Number: LQG15WZ2N6S02D; Supplier: Digikey; Supplier Part Number: 490-LQG15WZ2N6S02DCT-ND; RoHS: Yes; Category: Fixed Inductors; Stock: 3427; Pricing: 1=0.12, 10=0.093, 25=0.084, 50=0.0778, 100=0.0722, 250=0.06528, 500=0.06048, 1000=0.05605, 2500=0.05066 (USD); RoHS Compliant: Yes; ComponentLink1URL: https://search.murata.co.jp/Ceramy/image/img/P02/JELF243B-9117.pdf?src-supplier=Digikey; ComponentLink1Description: https://search.murata.co.jp/Ceramy/image/img/P02/JELF243B-9117.pdf?src-supplier=Digikey
L2 = Inductor_1.7nH: General Purpose Inductor, 0.0017uH, 17.647%, 1 Element, SMD, 0402; Manufacturer: Murata; Manufacturer Part Number: LQG15WZ1N7S02D; Supplier: Digikey; Supplier Part Number: 490-LQG15WZ1N7S02DCT-ND; RoHS: Yes; Category: Fixed Inductors; Stock: 5231; Pricing: 1=0.12, 10=0.093, 25=0.084, 50=0.0778, 100=0.0722, 250=0.06528, 500=0.06048, 1000=0.05605, 2500=0.05066 (USD); RoHS Compliant: Yes; ComponentLink1URL: https://search.murata.co.jp/Ceramy/image/img/P02/JELF243B-9117.pdf?src-supplier=Digikey; ComponentLink1Description: https://search.murata.co.jp/Ceramy/image/img/P02/JELF243B-9117.pdf?src-supplier=Digikey; ComponentLink2URL: https://datasheet.octopart.com/LQG15WZ1N7S02D-Murata-datasheet-150573548.pdf?src-supplier=Newark; ComponentLink2Description: https://datasheet.octopart.com/LQG15WZ1N7S02D-Murata-datasheet-150573548.pdf?src-supplier=Newark
R19 = CMP-26527-002098-1: 10kΩ ±5% 0.1W 0603 Thick Film Chip Resistor AEC-Q200 compliant; Manufacturer: Stackpole Electronics; Manufacturer Part Number: RMCF0603JT10K0; Power Rating: 100mW; Temperature Coefficient: 100ppm/°C; Resistance: 10kR; Rated Temperature: 70°C; Value: 10kR; Working Voltage: 75V; Package Height: 0.45mm; Package Length: 1.55mm; Package Width: 0.8mm; Radiation Hardening: No; Military Standard: Not; Mount: Surface Mount; Resistor Type: Thick Film; Size Code: 0603; Case/Package: 0603; Min Operating Temperature: -55°C; Construction: Rectangular; Series: RMCF; Width: 0.031inch; Length: 1.55mm; Case Code (Metric): 1608; Depth: 0.8mm; Height: 0.022inch; Packaging: Tape and Reel; Lead Free: Lead Free; Tolerance: 5%; Case Code (Imperial): 0603; Max Operating Temperature: 155°C; Contact Plating: Tin; Max Power Dissipation: 100mW; Features: Automotive AEC-Q200; Number of Terminations: 2; Supplier: Digikey; Supplier Part Number: RMCF0603JT10K0CT-ND; RoHS: Yes; Category: Chip SMD Resistors; Stock: 6956697; Pricing: 1=0.1, 10=0.021, 50=0.0116, 100=0.0093, 500=0.00594, 1000=0.005, 5000=0.00345, 10000=0.00299, 25000=0.0025, 35000=0.00242, 50000=0.00221, 125000=0.00196 (USD); Mounting Technology: Surface Mount; Pins: 2; Package Shape: Rectangular; Terminal Finish: Nickel; JESD-609 Code: e3; Package Style: SMTMeter; Power: 100mW; Technology: METAL GLAZE/THICK FILM; Termination: Wraparound; Reference Standard: AEC-Q200; Reach SVHC Compliant: Yes; RoHS Compliant: Yes; ComponentLink1URL: https://datasheet.ciiva.com:443/pdfs/VipMasterIC/IC/SEIE/SEIE-S-A0009541969/SEIE-S-A0009541969-1.pdf?src-supplier=IHS+Markit; ComponentLink1Description: https://datasheet.ciiva.com:443/pdfs/VipMasterIC/IC/SEIE/SEIE-S-A0009541969/SEIE-S-A0009541969-1.pdf?src-supplier=IHS+Markit; ComponentLink2URL: https://datasheet.ciiva.com/15193/getdatasheetpartid-364254-15193501.pdf?src-supplier=Verical; ComponentLink2Description: https://datasheet.ciiva.com/15193/getdatasheetpartid-364254-15193501.pdf?src-supplier=Verical
SW1 = CMP-1684-00021-1: Tact Switch, SPST-NO, 0.05 A, -35 to 85 degC, 4-Pin THD, RoHS, Bulk; Manufacturer: TE Connectivity; Maximum Contact Resistance: 100mOhm; Mechanical Life: 100000Cycles; Bushing Type: Unthreaded; Switch Configuration: OFF(ON); Maximum DC Voltage Rating: 24V; Contact Rating @ Voltage: 0.05A@24VDC; Actuator Color: Black; Body Orientation: Straight; Function: MomentaryContact; Illumination: N/R; Actuator Style: RoundButton; Actuator Material: PolybutyleneTerephthalate; Dielectric Strength: 500VAC; Pole Throw Configuration: SPST; Actuator Length: 1.4mm; Circuit Configuration: 1X1; Contact Current(DC)-Max: 50mA; Number of Switches: 1; Operating Force-Max: 2.06N; Switch Action: MOMENTARY; Switch Type: Keypad; Contact DC Max Rating R Load: .05A@24VDC; Body Breadth: 5.99inch; Body Height: 3.61mm; Body Length or Diameter: 5.99mm; Product Weight: N/A; Contact Material: CopperAlloy; Housing Material: N/A; Terminal Type: PCPins; Minimum Insulation Resistance: 100MOhm; Package Description: 4-Pin Through Hole Device, Body 5.99 x 5.99 mm, Pitch 6.5 mm; Part No: 1825910-6; Package Reference: THD; Base Material: N/A; Manufacturer URL: http://www.te.com; Contact Plating: Silver; RoHS: Yes; Datasheet Version: Rev. C9; Electrical Life: 100000Cycles; Maximum AC Voltage Rating: N/A; Thread Size: N/R; Operating Temperature: -35to85C; Mounting: ThroughHole; Dimension: 5.99x5mm; Datasheet URL: http://www.te.com/commerce/DocumentDelivery/DDEController?Action=showdoc&DocId=Customer+Drawing%7F1825910%7FC9%7Fpdf%7FEnglish%7FENG_CD_1825910_C9.pdf%7F1825910-6; Family: 1825910; Seal Location: N/A; Seal Description: N/A; Packaging: N/A; Supplier: Digikey; Supplier Part Number: 450-1650-ND; Manufacturer Part Number: 1825910-6; Category: Pushbutton Switches; Stock: 87502; Pricing: 1=0.16, 10=0.132, 25=0.1216, 100=0.1072, 250=0.09864, 750=0.08917, 1500=0.08362, 3000=0.07836, 5250=0.07432 (USD); Mounting Technology: Through Hole; Min Operating Temperature: -35°C; Max Operating Temperature: 85°C; Termination: Solder; Contact Voltage(DC)-Max: 24V; Switch Function: SPST; Reach SVHC Compliant: Yes; RoHS Compliant: Yes; ComponentLink1URL: https://datasheet.ciiva.com:443/pdfs/VipMasterIC/IC/TYEL/TYEL-S-A0008869674/TYEL-S-A0008850909-1.pdf?src-supplier=IHS+Markit; ComponentLink1Description: https://datasheet.ciiva.com:443/pdfs/VipMasterIC/IC/TYEL/TYEL-S-A0008869674/TYEL-S-A0008850909-1.pdf?src-supplier=IHS+Markit; ComponentLink2URL: https://datasheet.ciiva.com/30199/1825910-6rqpn1825910-6-30199520.pdf?src-supplier=Onlinecomponents.com; ComponentLink2Description: https://datasheet.ciiva.com/30199/1825910-6rqpn1825910-6-30199520.pdf?src-supplier=Onlinecomponents.com; ComponentLink3URL: https://datasheet.ciiva.com/15184/getdatasheetpartid-395915-15184509.pdf?src-supplier=Verical; ComponentLink3Description: https://datasheet.ciiva.com/15184/getdatasheetpartid-395915-15184509.pdf?src-supplier=Verical
U1 = EFR32BG24A020F1024IM48-B: BG24, 2.4 GHz, 1024kB Flash, 128kB RAM, +20 dBm, +125C, QFN48; Manufacturer: Silicon Labs; Supplier: Digikey; Supplier Part Number: 336-EFR32BG24A020F1024IM48-B-ND; Manufacturer Part Number: EFR32BG24A020F1024IM48-B; RoHS: No; Category: RF Receivers, Transceivers; Stock: 525; Pricing: 1=6.45, 10=5.757, 25=5.1812, 80=4.72075, 230=4.26017, 490=3.82265, 980=3.22392 (USD)
Y1 = CMP-27762-008022-1: Crystal 39MHz ±10ppm 12pF SMD-4 3.2mm x 2.5mm; Manufacturer: Abracon; Manufacturer Part Number: ABM8-39.000MHZ-12-B1U-T; Supplier: Digikey; Supplier Part Number: 535-14995-1-ND; RoHS: Yes; Category: Crystals; Stock: 2026; Pricing: 1=0.46, 10=0.396, 50=0.357, 100=0.3415, 500=0.30794 (USD); ComponentLink1URL: https://datasheet.ciiva.com:443/pdfs/VipMasterIC/IC/ABRC/ABRC-S-A0001358176/ABRC-S-A0001358176-1.pdf?src-supplier=IHS+Markit; ComponentLink1Description: https://datasheet.ciiva.com:443/pdfs/VipMasterIC/IC/ABRC/ABRC-S-A0001358176/ABRC-S-A0001358176-1.pdf?src-supplier=IHS+Markit; ComponentLink2URL: http://www.farnell.com/datasheets/2792510.pdf?src-supplier=Farnell; ComponentLink2Description: http://www.farnell.com/datasheets/2792510.pdf?src-supplier=Farnell; ComponentLink3URL: https://abracon.com/Resonators/abm8.pdf?src-supplier=Digikey; ComponentLink3Description: https://abracon.com/Resonators/abm8.pdf?src-supplier=Digikey; ComponentLink4URL: http://www.farnell.com/datasheets/2792510.pdf?src-supplier=Newark; ComponentLink4Description: http://www.farnell.com/datasheets/2792510.pdf?src-supplier=Newark; ComponentLink5URL: https://datasheet.octopart.com/ABM8-39.000MHZ-12-B1U-T-Abracon-datasheet-154833172.pdf?src-supplier=Sager+Electronics; ComponentLink5Description: https://datasheet.octopart.com/ABM8-39.000MHZ-12-B1U-T-Abracon-datasheet-154833172.pdf?src-supplier=Sager+Electronics; ComponentLink6URL: https://datasheet.octopart.com/ABM8-39.000MHZ-12-B1U-T-Abracon-datasheet-103059652.pdf?src-supplier=Master+Electronics; ComponentLink6Description: https://datasheet.octopart.com/ABM8-39.000MHZ-12-B1U-T-Abracon-datasheet-103059652.pdf?src-supplier=Master+Electronics